# Altium schematic sheet DCDC12180.SchDoc: =GlobalProjectName
size 420 x 297 mm; ApprovedBy: Утвердил; CheckedBy: Проверил; Author: Разработал; SheetNumber: Лист; SheetTotal: Листов; PageSetup: Record=PageOptions|CenterHorizontal=True|CenterVertical=True|PrintScale=1.00|XCorrection=1.00|YCorrection=1.00|PrintKind=1|BorderSize=5000000|LeftOffset=0|BottomOffset=0|Orientation=2|PaperLength=1000|PaperWidth=1000|Scale=100|PaperSource=15|PrintQuality=1200|MediaType=1|DitherType=10|PaperKind=A3|PrintScaleMode=1; Weight: -; ScaleFactor: -; NormInspection: Норм.Контр.
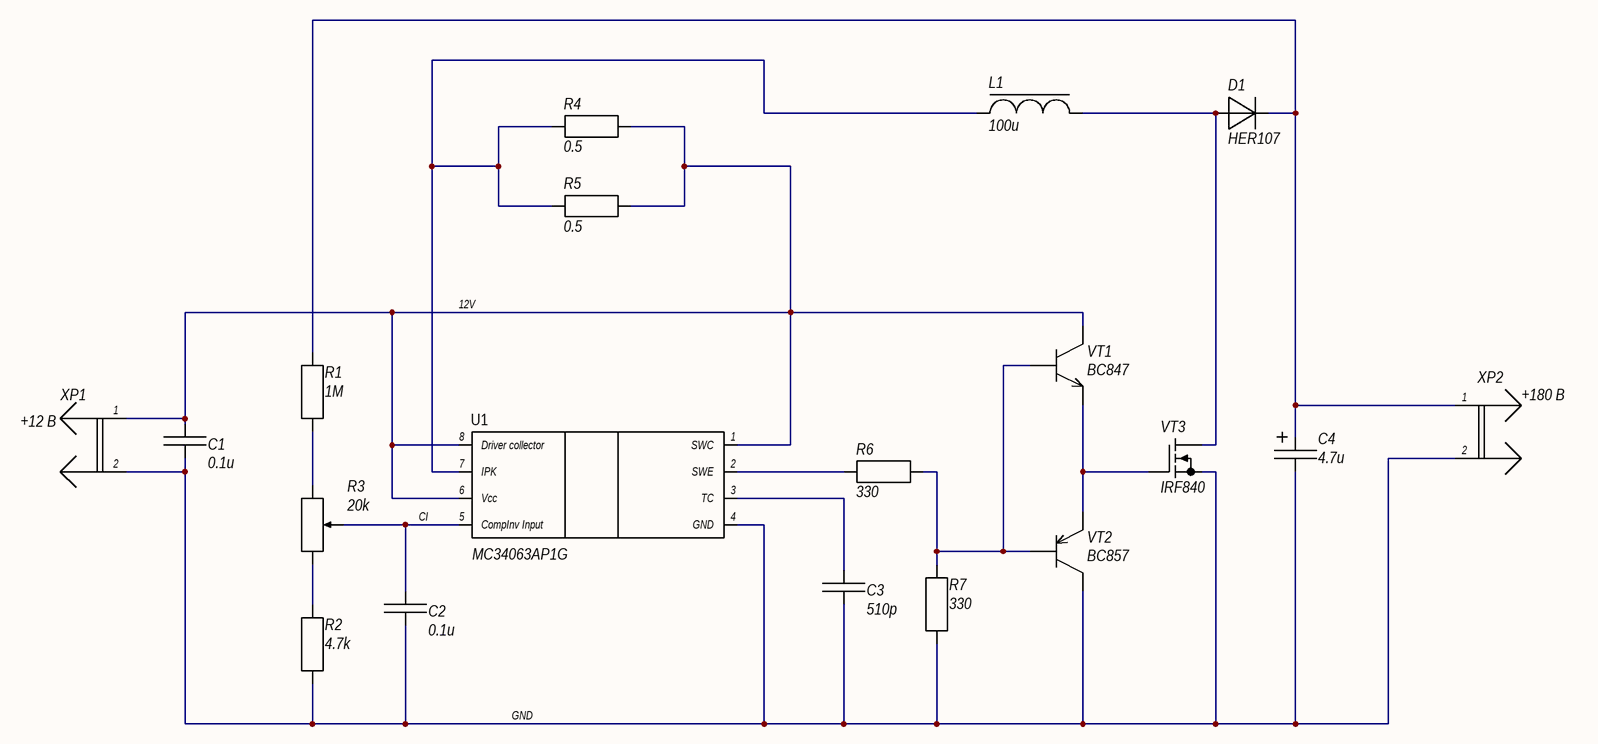
[diagram p0: DCDC12180.SchDoc]

## Parts
C1  0.1u  [C1206]
C2  0.1u  [C1206]
C3  510p  [C1206]
C4  4.7u  [ECAP-10x16-5]
D1  HER107  [DO-41]
L1  100u  [INDUCTOR 0912]
R1  1M  [R1206]
R2  4.7k  [R1206]
R3  20k  [3362P]
R4  0.5  [R2512]
R5  0.5  [R2512]
R6  330  [R1206]
R7  330  [R1206]
U1  MC34063AP1G  [DIP8]
VT1  BC847  [SOT-23]
VT2  BC857  [SOT-23]
VT3  IRF840  [TO-220_HORIZONTAL]
XP1  +12 В  [2_PIN_INPUT]
XP2  +180 В  [2_PIN_INPUT]

## Nets
12V: C1.2 R4.2 R5.2 U1.1(SWC) U1.6(Vcc) U1.8(Driver_collector) VT1.3(К) XP1.1
CI: C2.2 R3.2(TAP) U1.5(CompInv_Input)
GND: C1.1 C2.1 C3.1 C4.2 R2.1 R7.1 U1.4(GND) VT2.3(К) VT3.3(S) XP1.2 XP2.2
NetC3_2: C3.2 U1.3(TC)
NetC4_1: C4.1 D1.C R1.2 XP2.1
NetD1_A: D1.A L1.2 VT3.2(D)
NetL1_1: L1.1 R4.1 R5.1 U1.7(IPK)
NetR1_1: R1.1 R3.1
NetR2_2: R2.2 R3.3
NetR6_1: R6.1 R7.2 VT1.1(Б) VT2.1(Б)
NetR6_2: R6.2 U1.2(SWE)
NetVT1_2: VT1.2(Э) VT2.2(Э) VT3.1(G)

## Notes on the sheet
- Перв. примен.
- Справ. №
- Подп. и дата
- Инв. № дубл.
- Взам. инв. №
- Разраб.
- Изм.
- Лист
- № докум.
- Подп.
- Дата
- Литера
- Масса
- Масштаб
- Пров.
- Т.контр.
- Листов
- Инв. № подл.
- Н.контр.
- Утв.
- Форма 1 ГОСТ 2.104-2006
- Копировал
- Формат А4

## Library data of the parts
C1-C3 = CAPACITOR: MODEL: *; MANUFATURER: *; CASE: 1206
  C1 C2: VALUE: 0.1u; URL: https://www.chipdip.ru/product/grm319r71h104k
  C3: VALUE: 510p; URL: https://www.chipdip.ru/product0/508137853
C4 = CAPACITOR_ECAP: VALUE: 4.7u; MODEL: *; MANUFATURER: *; CASE: *; URL: *
D1 = DIOD: MODEL: HER107; URL: *
L1 = INDUCTOR: VALUE: 100u
R1 R2 R4-R7 = RESISTOR: MODEL: *; MANUFACTURER: *
  R1: URL: https://www.chipdip.ru/product0/690816980; CASE: 1206; VALUE: 1M
  R2: URL: https://www.chipdip.ru/product0/9000079651; CASE: 1206; VALUE: 4.7k
  R4 R5: URL: https://www.aliexpress.com/item/50Pcs-2512-SMD-chip-fixed-resistor-1-1W-0-1R-0-01R-0-05R-0-001R/32847362977.html?spm=a2g0s.9042311.0.0.274233ed5x5DIN; CASE: 2512; VALUE: 0.5
  R6 R7: URL: https://www.chipdip.ru/product0/9000079903; CASE: 1206; VALUE: 330
R3 = RESISTOR-VARIABLE: URL: https://www.chipdip.ru/product/3362p-1-203; VALUE: 20k; TYPE: 3362P
U1 = IC-MC34063A: MODEL: MC34063AP1G; URL: https://www.chipdip.ru/product/mc34063ap1g
VT1 = TRANSISTOR_BC847: MODEL: BC847; URL: *
VT2 = TRANSISTOR_BC857: MODEL: BC857; URL: *
XP1 XP2 = Con-2-M: Value: Connector; Published: 07.03.2013; Publisher: Andrew Danich; Type: Вилка
VT3 = IRF840: MODEL: IRF840; URL: *; CASE: *